# Altium schematic sheet BRIDGE.SchDoc
size A4
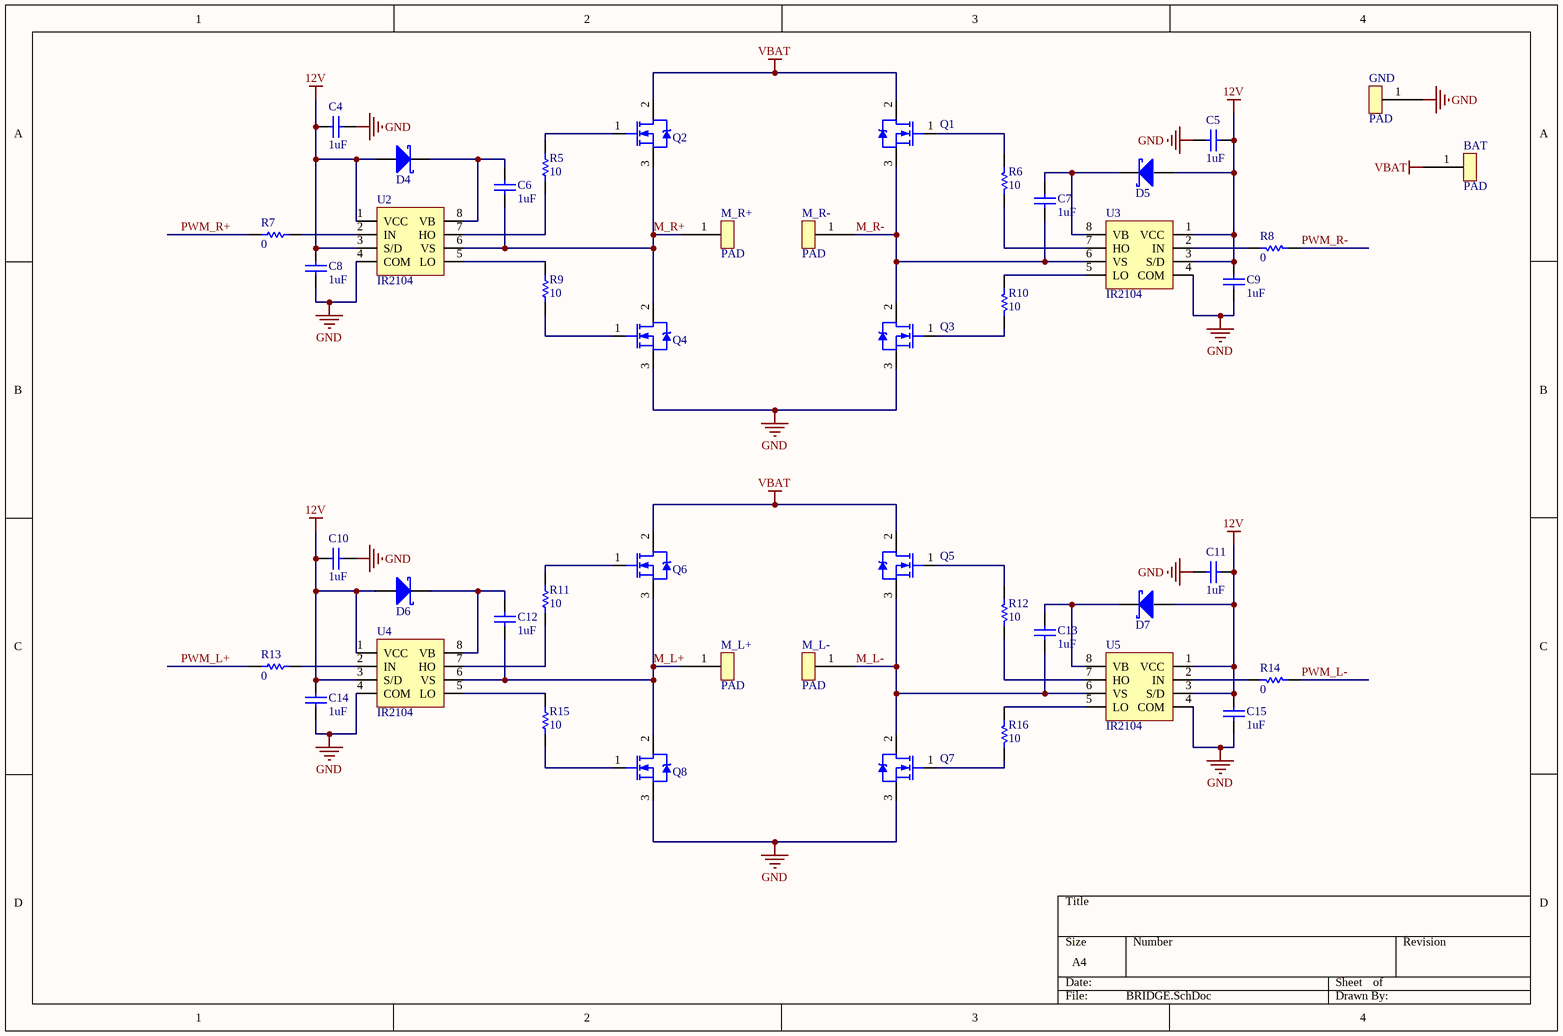
[diagram p0: BRIDGE.SchDoc]

## Parts
BAT  PAD  [PAD_BIG]
C4  1uF  [C1210]
C5  1uF  [C1210]
C6  1uF  [0603_C]
C7  1uF  [0603_C]
C8  1uF  [0603_C]
C9  1uF  [0603_C]
C10  1uF  [C1210]
C11  1uF  [C1210]
C12  1uF  [0603_C]
C13  1uF  [0603_C]
C14  1uF  [0603_C]
C15  1uF  [0603_C]
D4  Diode Schottky  [DO-214AC]  (value not drawn)
D5  Diode Schottky  [DO-214AC]  (value not drawn)
D6  Diode Schottky  [DO-214AC]  (value not drawn)
D7  Diode Schottky  [DO-214AC]  (value not drawn)
GND  PAD  [PAD_BIG]
M_L+  PAD  [PAD_BIG]
M_L-  PAD  [PAD_BIG]
M_R+  PAD  [PAD_BIG]
M_R-  PAD  [PAD_BIG]
Q1  MOSFET N  [TO-252AA]  (value not drawn)
Q2  MOSFET N  [TO-252AA]  (value not drawn)
Q3  MOSFET N  [TO-252AA]  (value not drawn)
Q4  MOSFET N  [TO-252AA]  (value not drawn)
Q5  MOSFET N  [TO-252AA]  (value not drawn)
Q6  MOSFET N  [TO-252AA]  (value not drawn)
Q7  MOSFET N  [TO-252AA]  (value not drawn)
Q8  MOSFET N  [TO-252AA]  (value not drawn)
R5  10  [0603_R]
R6  10  [0603_R]
R7  0  [0603_R]
R8  0  [0603_R]
R9  10  [0603_R]
R10  10  [0603_R]
R11  10  [0603_R]
R12  10  [0603_R]
R13  0  [0603_R]
R14  0  [0603_R]
R15  10  [0603_R]
R16  10  [0603_R]
U2  IR2104  [SOIC-8]
U3  IR2104  [SOIC-8]
U4  IR2104  [SOIC-8]
U5  IR2104  [SOIC-8]

## Nets
12V: C4.1 C5.2 C8.2 C9.2 C10.1 C11.2 C14.2 C15.2 D4.1(A) D5.1(A) D6.1(A) D7.1(A) U2.1(VCC) U2.3(S/D) U3.1(VCC) U3.3(S/D) U4.1(VCC) U4.3(S/D) U5.1(VCC) U5.3(S/D)
GND: C4.2 C5.1 C8.1 C9.1 C10.2 C11.1 C14.1 C15.1 GND.1 Q3.3(S) Q4.3(S) Q7.3(S) Q8.3(S) U2.4(COM) U3.4(COM) U4.4(COM) U5.4(COM)
VBAT: BAT.1 Q1.2(D) Q2.2(D) Q5.2(D) Q6.2(D)
M_L+: C12.1 M_L+.1 Q6.3(S) Q8.2(D) U4.6(VS)
M_L-: C13.1 M_L-.1 Q5.3(S) Q7.2(D) U5.6(VS)
M_R+: C6.1 M_R+.1 Q2.3(S) Q4.2(D) U2.6(VS)
M_R-: C7.1 M_R-.1 Q1.3(S) Q3.2(D) U3.6(VS)
PWM_L+: R13.1
PWM_L-: R14.1
PWM_R+: R7.1
PWM_R-: R8.1
NetC6_2: C6.2 D4.2(K) U2.8(VB)
NetC7_2: C7.2 D5.2(K) U3.8(VB)
NetC12_2: C12.2 D6.2(K) U4.8(VB)
NetC13_2: C13.2 D7.2(K) U5.8(VB)
NetQ1_1: Q1.1(G) R6.2
NetQ2_1: Q2.1(G) R5.2
NetQ3_1: Q3.1(G) R10.2
NetQ4_1: Q4.1(G) R9.2
NetQ5_1: Q5.1(G) R12.2
NetQ6_1: Q6.1(G) R11.2
NetQ7_1: Q7.1(G) R16.2
NetQ8_1: Q8.1(G) R15.2
NetR5_1: R5.1 U2.7(HO)
NetR6_1: R6.1 U3.7(HO)
NetR7_2: R7.2 U2.2(IN)
NetR8_2: R8.2 U3.2(IN)
NetR9_1: R9.1 U2.5(LO)
NetR10_1: R10.1 U3.5(LO)
NetR11_1: R11.1 U4.7(HO)
NetR12_1: R12.1 U5.7(HO)
NetR13_2: R13.2 U4.2(IN)
NetR14_2: R14.2 U5.2(IN)
NetR15_1: R15.1 U4.5(LO)
NetR16_1: R16.1 U5.5(LO)

## Library data of the parts
C4-C15 = CAP: Capacitor; Value: 104; Published: 8-Jun-2000; LatestRevisionDate: 17-Jul-2002; LatestRevisionNote: Re-released for DXP Platform.; PackageReference: RAD-0.3; Publisher: Altium Limited
R5-R16 = RES: Resistor; Value: 1K; Published: 8-Jun-2000; Revision: July-2002: Re-released for DXP Platform.; Publisher: Altium Limited
U2-U5 = IR2104: 半桥驱动器